# EasyEDA Pro project CameraTargetV1-old.eprj, schematic Schematic1
Create Date: 2023-02-02; Page Name: P1; Project Name: CameraTargetV1; Schematic Name: Schematic1; Update Date: 2023-02-07
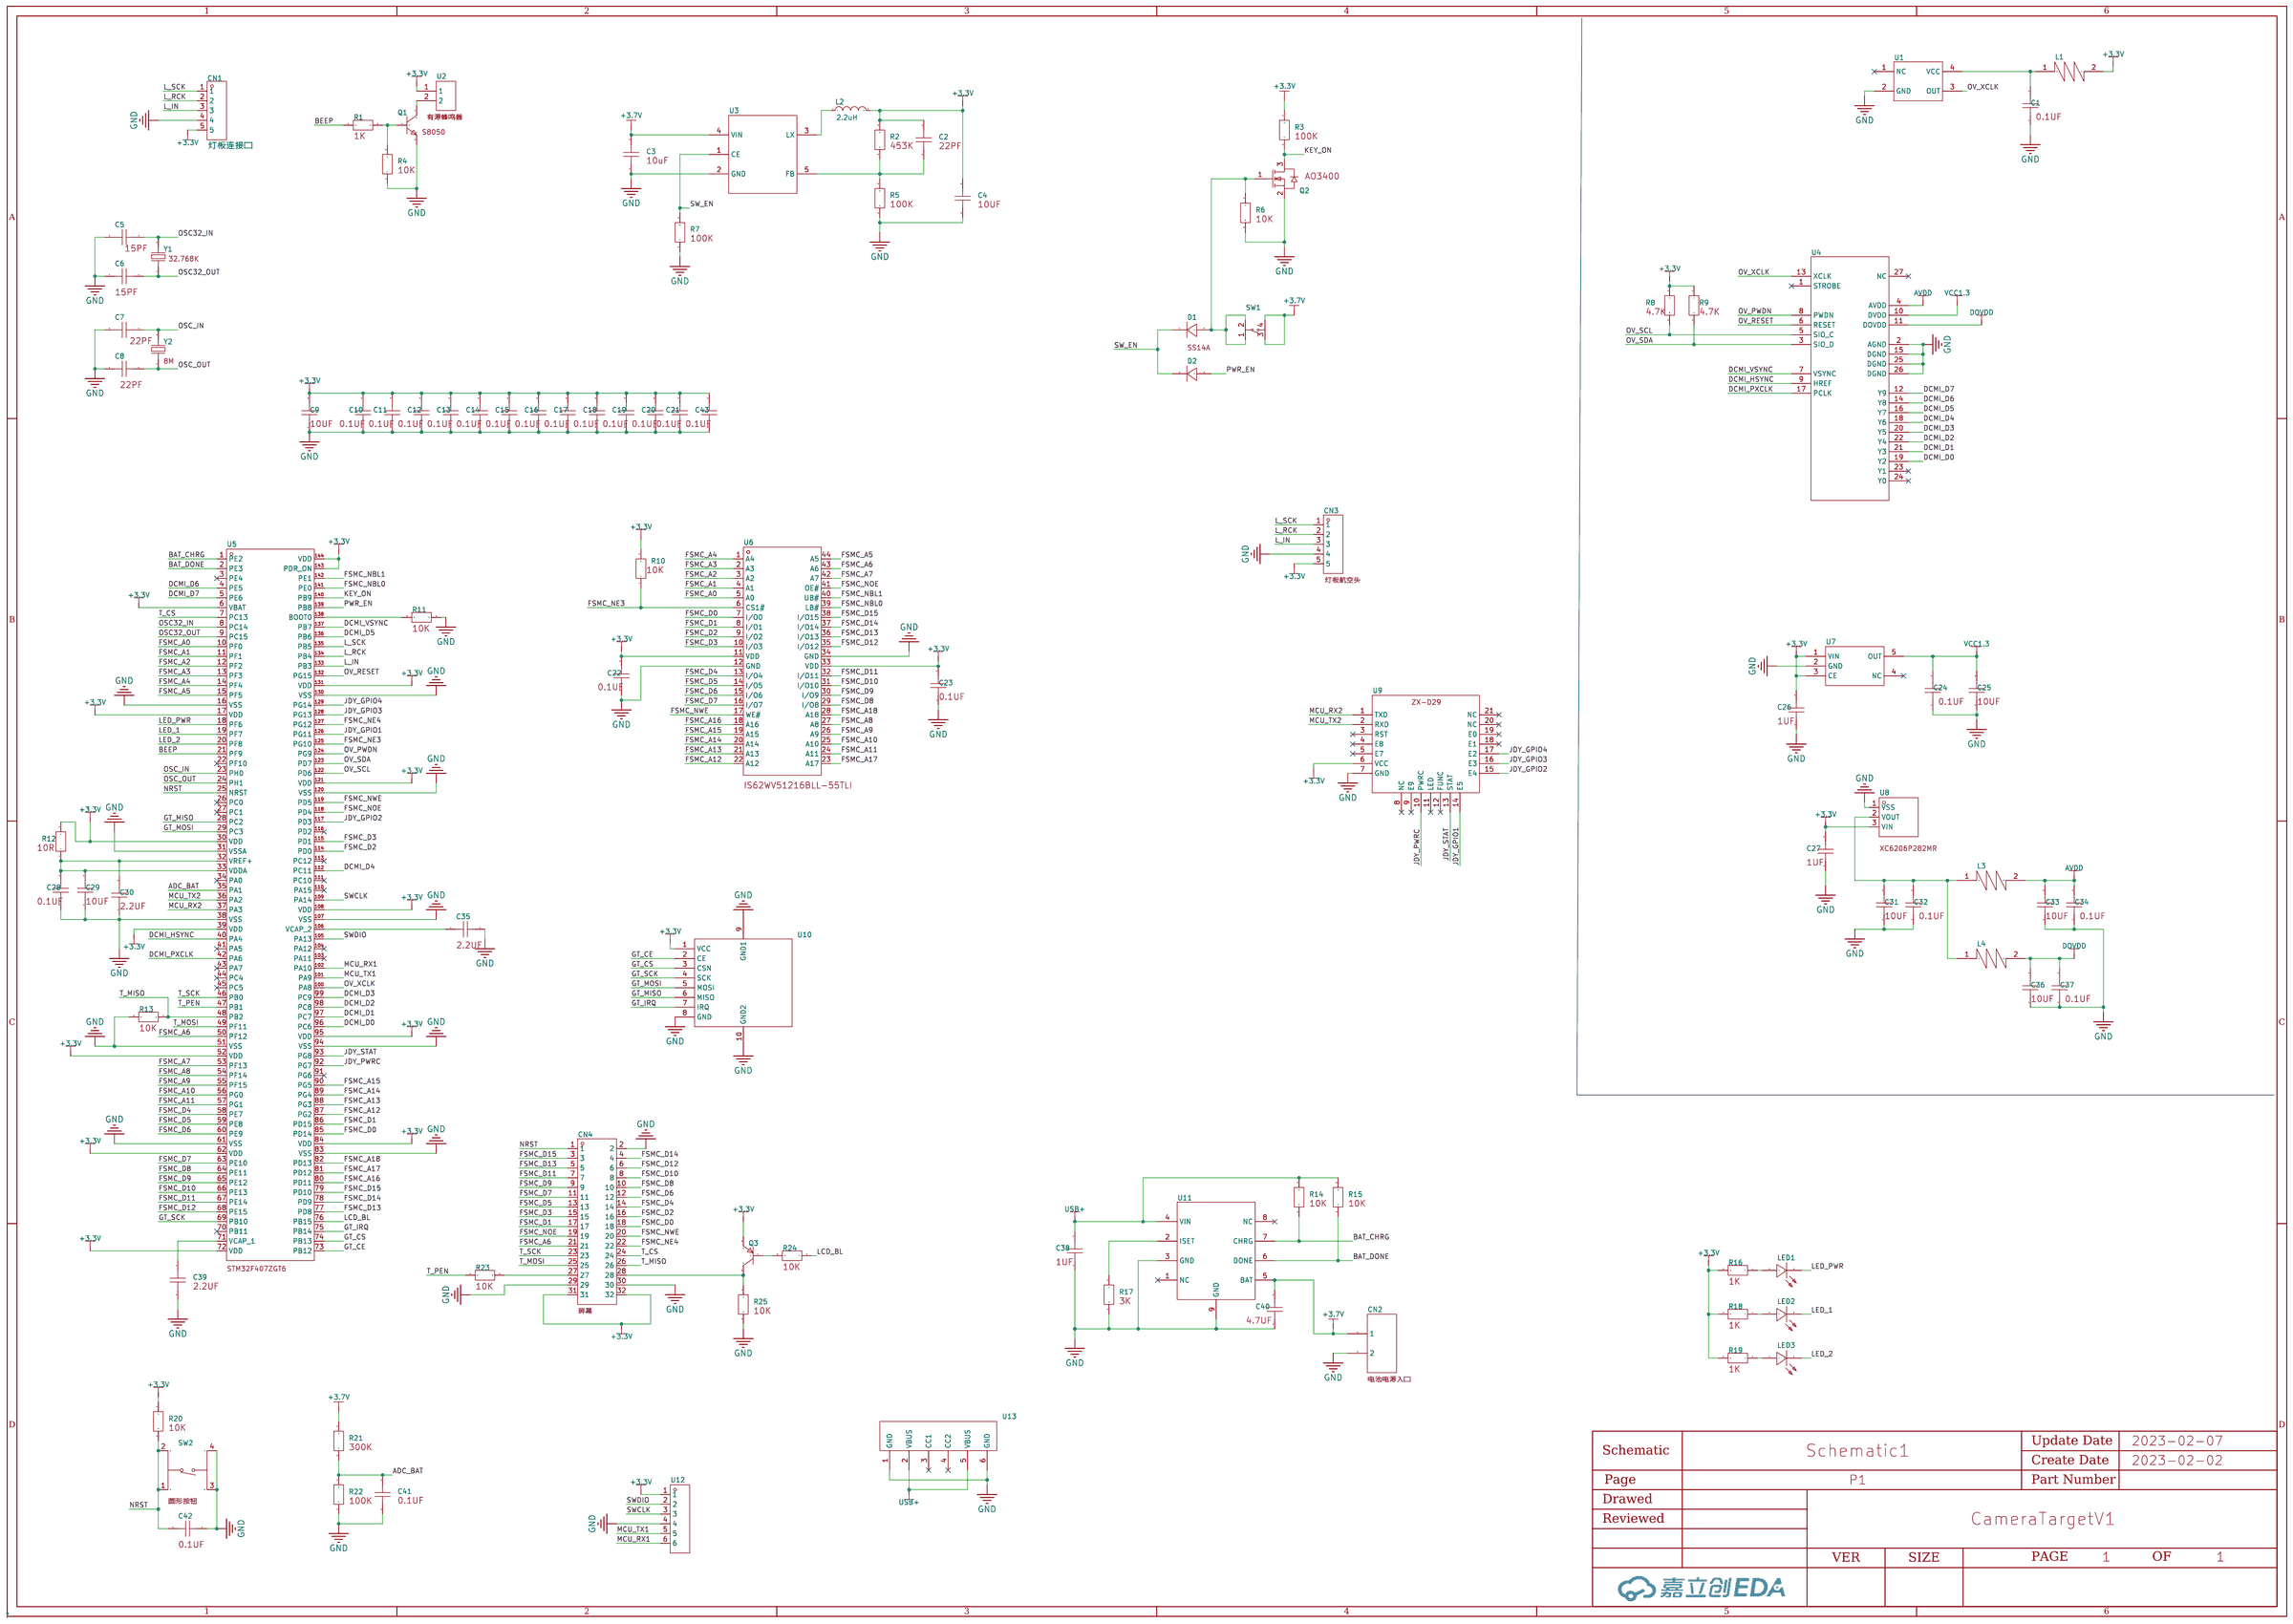
[diagram p0: schematic sheet]

## Parts
C1  -  [0603]
C2  -  [0603]
C3  -  [0603]
C4  -  [0603]
C5  -  [0603]
C6  -  [0603]
C7  -  [0603]
C8  -  [0603]
C9  -  [0603]
C10  -  [0603]
C11  -  [0603]
C12  -  [0603]
C13  -  [0603]
C14  -  [0603]
C15  -  [0603]
C16  -  [0603]
C17  -  [0603]
C18  -  [0603]
C19  -  [0603]
C20  -  [0603]
C21  -  [0603]
C22  -  [0603]
C23  -  [0603]
C24  -  [0603]
C25  -  [0603]
C26  -  [0603]
C27  -  [0603]
C28  -  [0603]
C29  -  [0603]
C30  -  [0603]
C31  -  [0603]
C32  -  [0603]
C33  -  [0603]
C34  -  [0603]
C35  -  [0603]
C36  -  [0603]
C37  -  [0603]
C38  -  [0603]
C39  -  [0603]
C40  -  [0603]
C41  -  [0603]
C42  -  [0603]
C43  -  [0603]
CN1  灯板连接口  [CONN-TH_5P-P2.50_HX25003-5A]
CN2  -  [XH2.54插件2P]
CN3  HDGC2501WR-5P  [CONN-TH_5P-P2.50_HDGC2501WR-5P]
CN4  BH-00169  [IDC-TH_BH-00169]
D1  SS14A  [SMA_L4.3-W2.6-LS5.2-RD]
D2  SS14A  [SMA_L4.3-W2.6-LS5.2-RD]
L1  -  [0420]
L2  2.2uH  [IND-SMD_L4.0-W4.0_0.47UH04209.5A]
L3  -  [0420]
L4  -  [0420]
LED1  RED  [LED0603-R-RD_RED]
LED2  NCD0603R3  [LED0603-R-RD_RED]
LED3  NCD0603R3  [LED0603-R-RD_RED]
Q1  S8050  [SOT-23-3_L2.9-W1.6-P1.90-LS2.8-BR]
Q2  AO3400  [SOT-23_L2.9-W1.3-P1.90-LS2.4-BR]
Q3  S9012  [SOT-23-3_L2.9-W1.6-P1.90-LS2.8-BR]
R1  -  [0603]
R2  -  [0603]
R3  -  [0603]
R4  -  [0603]
R5  -  [0603]
R6  -  [0603]
R7  -  [0603]
R8  -  [0603]
R9  -  [0603]
R10  -  [0603]
R11  -  [0603]
R12  -  [0603]
R13  -  [0603]
R14  -  [0603]
R15  -  [0603]
R16  -  [0603]
R17  -  [0603]
R18  -  [0603]
R19  -  [0603]
R20  -  [0603]
R21  -  [0603]
R22  -  [0603]
R23  -  [0603]
R24  -  [0603]
R25  -  [0603]
SW1  -  [按钮开关]
SW2  1TS001G-2700-1500-CT  [SW-SMD_4P-L5.1-W5.1-P3.70-LS6.5-TL-2]
U1  -  [5032-4P]
U2  -  [0905蜂鸣器]
U3  -  [PW2051]
U4  -  [OV2640]
U5  STM32F407ZGT6  [LQFP-144_L20.0-W20.0-P0.50-LS22.0-BL]
U6  IS62WV51216BLL-55TLI  [TSOP-44_L18.4-W10.2-P0.80-LS11.8-BL]
U7  -  [XC6219B132MR]
U8  XC6206P282MR  [SOT-23-3_L2.9-W1.3-P1.90-LS2.4-BR]
U9  -  [ZX-D29]
U10  -  [GT-24]
U11  -  [PW4056]
U12  HDGC2501WR-6P  [CONN-TH_6P-P2.50_HDGC_HDGC2501WR-6P]
U13  -  [typec]
Y1  -  [3215]
Y2  -  [5032]

## Library data of the parts
C1 C10-C24 C28 C32 C34 C37 C41-C43 = 电容: 0603 标准贴片电容; Capacitance: 0.1UF
C2 C7 C8 = 电容: 0603 标准贴片电容; Capacitance: 22PF
C3 = 电容: 0603 标准贴片电容; Capacitance: 10uF
C4 C9 C25 C29 C31 C33 C36 = 电容: 0603 标准贴片电容; Capacitance: 10UF
C5 C6 = 电容: 0603 标准贴片电容; Capacitance: 15PF
C26 C27 C38 = 电容: 0603 标准贴片电容; Capacitance: 1UF
C30 C35 C39 = 电容: 0603 标准贴片电容; Capacitance: 2.2UF
C40 = 电容: 0603 标准贴片电容; Capacitance: 4.7UF
CN1 = HX25003-5A: 参考系列:XH;间距:2.5mm;插针结构:1x5P;排数:1;每排PIN数:5;行距:-;公母:公型插针;安装方式:直插;额定电流:-;工作温度范围:-;; LCSC Part Name: XH 2.5mm 1x5P 直插; Supplier Part: C442302; Manufacturer: HX(红星); Supplier Footprint: 插件,P=2.5mm; JLCPCB Part Class: Extended Part; Datasheet: https://atta.szlcsc.com/upload/public/pdf/source/20191028/C442302_E66AD84792E19526D7353D56EEE1C29F.pdf; Supplier: LCSC; Reference Series: XH; Pitch: 2.5mm; Pins Structure: 1x5P; Number of Rows: 1; Number of PINs Per Row: 5; Gender: 公型插针; Mounting Style: 直插
CN2 = XH2.54插件2P: 电池电源入口
CN3 = HDGC2501WR-5P: 灯板航空头; LCSC Part Name: XH2.5弯针 5P; Supplier Part: C5175258; Manufacturer: HDGC(华德共创); Supplier Footprint: 弯插,P=2.5mm; Datasheet: https://atta.szlcsc.com/upload/public/pdf/source/20220916/5D6D01E77D919FBB15E2FEFFF7AE5019.pdf; Supplier: LCSC
CN4 = BH-00169: 屏幕; LCSC Part Name: 2.54mm 每排P数:16 排数:2; Supplier Part: C2685073; Manufacturer: Liansheng(连盛); Supplier Footprint: 直插,P=2.54mm; JLCPCB Part Class: Extended Part; Datasheet: https://atta.szlcsc.com/upload/public/pdf/source/20210125/C2685073_294C4BB09F754431070A9C1995E03CCF.pdf; Supplier: LCSC; Connector Type: 简牛座; Pitch: 2.54mm; Pin Number in each Row: 16; Number of Rows: 2; Row Spacing: 2.54mm; Holder Type: 直插; Current Rating (Max): 3A; Operating Temperature Range: -40~+105
D1 D2 = SS14A: 直流反向耐压(Vr):40V;平均整流电流(Io):1A;正向压降(Vf):500mV@1A;; LCSC Part Name: 40V 1A 500mV@1A; Supplier Part: C211770; Manufacturer: YANGJIE(扬杰); Supplier Footprint: SMA(DO-214AC); JLCPCB Part Class: Extended Part; Datasheet: https://atta.szlcsc.com/upload/public/pdf/source/20180504/C211770_627C435F34E9C107E4A4301F69D28675.pdf; Supplier: LCSC; Reverse Voltage (Vr): 40V; Average Rectified Current (Io): 1A; Forward Voltage (Vf@If): 500mV@1A
L1 L3 L4 = 3.3uh电感
L2 = 2.2uh3a电感: 电感值:2.2uH;精度:±20%;额定电流:3A;直流电阻(DCR):-;; Rated Current: 3A; Supplier: LCSC; Supplier Part: C438930; Supplier Footprint: SMD; LCSC Part Name: 2.2uH ±20% 3A; Tolerance: ±20%; Manufacturer: Cybermax(思博科技); Manufacturer Part: CMLO0420H2R2MTT
LED1-LED3 = NCD0603R3: 尺寸1.6x0.8x0.8；IF=20ma：1.6~2.6v，620~640nm,51~150mcd金线，光强高，功耗低，可靠性好，寿命长; LCSC Part Name: 红色;贴片LED;0603红灯;; Supplier Part: C3151730; Manufacturer: 国星光电; Supplier Footprint: 0603; JLCPCB Part Class: Extended Part; Datasheet: https://atta.szlcsc.com/upload/public/pdf/source/20220704/CBFF28C1847A97213A75929E60B7DDE7.pdf; Supplier: LCSC
Q1 = S8050_C105433: 晶体管类型:NPN;集射极击穿电压(Vceo):25V;集电极电流(Ic):500mA;功率(Pd):300mW;集电极截止电流(Icbo):100nA;集电极-发射极饱和电压(VCE(sat)@Ic,Ib):600mV@500mA,50mA;直流电流增益(hFE@Ic,Vce):120@50mA,1V;特征频率(fT):150MHz;工作温度:+150@(Tj);; LCSC Part Name: NPN 25V 500mA L档 120-200; Supplier Part: C105433; Manufacturer: CJ(江苏长电/长晶); Supplier Footprint: SOT-23-3L; JLCPCB Part Class: Extended Part; Datasheet: https://atta.szlcsc.com/upload/public/pdf/source/20170415/1492237762328.pdf; Supplier: LCSC; Transistor Type: NPN; Collector-Emitter Breakdown Voltage (Vceo): 25V; Collector Current (Ic): 500mA; Power Dissipation (Pd): 300mW; Collector Cut-Off Current (Icbo): 100nA; Collector-Emitter Saturation Voltage (VCE(sat)@Ic,Ib): 600mV@500mA,50mA; DC Current Gain (hFE@Ic,Vce): 120@50mA,1V; Transition Frequency (fT): 150MHz; Operating Temperature: +150@(Tj)
Q2 = AO3400: 类型:N沟道;漏源电压(Vdss):30V;连续漏极电流(Id):5.8A;功率(Pd):1.5W;导通电阻(RDS(on)@Vgs,Id):35mΩ@10V,5.8A;阈值电压(Vgs(th)@Id):1.2V@250uA;栅极电荷(Qg@Vgs):-;输入电容(Ciss@Vds):1050pF@15V;反向传输电容(Crss@Vds):77pF@15V;工作温度:+150@(Tj);; LCSC Part Name: N沟道 30V 5.8A; Supplier Part: C2938367; Manufacturer: GOODWORK(固得沃克); Supplier Footprint: SOT23; JLCPCB Part Class: Extended Part; Datasheet: https://atta.szlcsc.com/upload/public/pdf/source/20211229/1DE691E24B5B31BB262C463D0489A9AB.pdf; Supplier: LCSC; Type: N沟道; Drain Source Voltage (Vdss): 30V; Continuous Drain Current (Id): 5.8A; Power Dissipation (Pd): 1.5W; Drain Source On Resistance (RDS(on)@Vgs,Id): 35mΩ@10V,5.8A; Gate Threshold Voltage (Vgs(th)@Id): 1.2V@250uA; Input Capacitance (Ciss@Vds): 1050pF@15V; Reverse Transfer Capacitance (Crss@Vds): 77pF@15V; Operating Temperature: +150@(Tj)
Q3 = S9012_C107405: 晶体管类型:PNP;集射极击穿电压(Vceo):25V;集电极电流(Ic):500mA;功率(Pd):300mW;集电极截止电流(Icbo):100nA;集电极-发射极饱和电压(VCE(sat)@Ic,Ib):600mV@500mA,50mA;直流电流增益(hFE@Ic,Vce):120@50mA,1V;特征频率(fT):150MHz;工作温度:+150@(Tj);; LCSC Part Name: PNP 25V 500mA; Supplier Part: C107405; Manufacturer: CJ(江苏长电/长晶); Supplier Footprint: SOT-23-3L; JLCPCB Part Class: Extended Part; Datasheet: https://atta.szlcsc.com/upload/public/pdf/source/20170413/1492062773144.pdf; Supplier: LCSC; Transistor Type: PNP; Collector-Emitter Breakdown Voltage (Vceo): 25V; Collector Current (Ic): 500mA; Power Dissipation (Pd): 300mW; Collector Cut-Off Current (Icbo): 100nA; Collector-Emitter Saturation Voltage (VCE(sat)@Ic,Ib): 600mV@500mA,50mA; DC Current Gain (hFE@Ic,Vce): 120@50mA,1V; Transition Frequency (fT): 150MHz; Operating Temperature: +150@(Tj)
R1 R16 R18 R19 = 电阻: 0603 标准贴片电阻; Resistance: 1K
R2 = 电阻: 0603 标准贴片电阻; Resistance: 453K
R3 R5 R7 R22 = 电阻: 0603 标准贴片电阻; Resistance: 100K
R4 R6 R10 R11 R13-R15 R20 R23-R25 = 电阻: 0603 标准贴片电阻; Resistance: 10K
R8 R9 = 电阻: 0603 标准贴片电阻; Resistance: 4.7K
R12 = 电阻: 0603 标准贴片电阻; Resistance: 10R
R17 = 电阻: 0603 标准贴片电阻; Resistance: 3K
R21 = 电阻: 0603 标准贴片电阻; Resistance: 300K
SW1 = 按键开关
SW2 = 1TS001G-2700-1500-CT: 触点电流:20mA;额定电压(DC):12V;电路结构:单刀单掷;安装方式:立贴;按钮形状:圆形按钮;带灯:-;开关长度:5.1mm;开关宽度:5.1mm;开关高度:0.3mm;; LCSC Part Name: 铜头按钮; Supplier Part: C318800; Manufacturer: HYP(鸿源精密); Supplier Footprint: SMD,5.1x5.1mm; JLCPCB Part Class: Extended Part; Datasheet: https://atta.szlcsc.com/upload/public/pdf/source/20200109/C318800_E3EE45BECD3EEEC6701309AC007B685B.pdf; Supplier: LCSC; Contact Current: 20mA; Voltage Rating (DC): 12V; Circuit: 单刀单掷; Mounting Style: 立贴; Actuator Style: 圆形按钮; Switch Length: 5.1mm; Switch Width: 5.1mm; Switch Height: 0.3mm
U1 = 24M有源晶振
U2 = 0905蜂鸣器
U3 = PW2051: 3.7V转3.3V降压芯片
U4 = OV2640
U5 = STM32F407ZGT6: CPU内核:ARM Cortex-M4;CPU最大主频:168MHz;工作电压范围:1.8V~3.6V;内部振荡器:有;程序 FLASH容量:1MB;RAM总容量:192KB;EEPROM/数据 FLASH容量:-;GPIO端口数量:114;ADC(单元数/通道数/位数):1@x24ch/12bit;DAC(单元数/通道数/位数):1@x2ch/12bit;外设/功能/协议栈:欠压检测/复位；DMA；LCD驱动；看门狗；POR；PWM;工作温度范围:-40~+85;; LCSC Part Name: ARM Cortex-M4 168MHz 闪存：1MB RAM：192KB; Supplier Part: C19156; Manufacturer: ST(意法半导体); Supplier Footprint: LQFP-144(20x20); JLCPCB Part Class: Extended Part; Datasheet: https://atta.szlcsc.com/upload/public/pdf/source/20140724/1457707162528.pdf; Supplier: LCSC; CPU Core: ARM Cortex-M4; Maximum Frequency: 168MHz; Supply Voltage Range: 1.8V~3.6V; Internal Oscillator: 有; Program FLASH Size: 1MB; RAM Size: 192KB; GPIO Ports Number: 114; ADC (Units/Channels/bits): 1@x24ch/12bit; DAC (Units/Channels/bits): 1@x2ch/12bit; Peripherals / Functions / Protocol Stacks: 欠压检测/复位；DMA；LCD驱动；看门狗；POR；PWM; Operating Temperature Range: -40~+85
U6 = IS62WV51216BLL-55TLI: 8-Mbit(512K  16bit)，并行接口，工作电压：2.5V to 3.6V; Supplier Part: C11315; Manufacturer: ISSI(美国芯成); Supplier Footprint: TSOP-44-10.2mm; JLCPCB Part Class: Extended Part; Datasheet: https://atta.szlcsc.com/upload/public/pdf/source/20130225/1457706593006.pdf; Supplier: LCSC
U7 = XC6219B132MR: 3.3V转1.3V电压芯片
U8 = XC6206P282MR: Supplier Part: C2934870; Manufacturer: YONGYUTAI(永裕泰); Supplier Footprint: SOT-23; JLCPCB Part Class: Extended Part; Datasheet: https://atta.szlcsc.com/upload/public/pdf/source/20211028/7BAE2D9FEDA11A30305FD6FAB15CFEC6.pdf; Supplier: LCSC
U9 = ZX-D29: 蓝牙5.0模块
U10 = GT-24
U11 = PW4056: 带OVP充电芯片
U12 = HDGC2501WR-6P: LCSC Part Name: XH2.5弯针 6P; Supplier Part: C5175259; Manufacturer: HDGC(华德共创); Supplier Footprint: 弯插,P=2.5mm; JLCPCB Part Class: Extended Part; Datasheet: https://atta.szlcsc.com/upload/public/pdf/source/20220916/1B5A21F1CD201E9CB820F8C57DCAD896.pdf; Supplier: LCSC
U13 = typec: type c接口
Y1 = 32.768KHz晶振: 32.768K
Y2 = 8MHz晶振: 8M

## Nets
+3.3V: C2.2 C4.2 C9.2 C10.2 C11.2 C12.2 C13.2 C14.2 C15.2 C16.2 C17.2 C18.2 C19.2 C20.2 C21.2 C22.2 C23.2 C26.2 C27.2 C43.2 CN1.5 CN3.5 CN4.31 CN4.32 L1.2 L2.2 Q3.2 R2.2 R3.1 R8.1 R9.1 R10.2 R12.2 R16.2 R18.2 R19.2 R20.1 U2.1 U5.6(VBAT) U5.17(VDD) U5.30(VDD) U5.39(VDD) U5.52(VDD) U5.62(VDD) U5.72(VDD) U5.84(VDD) U5.95(VDD) U5.108(VDD) U5.121(VDD) U5.131(VDD) U5.143(PDR_ON) U5.144(VDD) U6.11(VDD) U6.33(VDD) U7.1(VIN) U7.3(CE) U8.3(VIN) U9.6(VCC) U10.1(VCC) U12.1
+3.7V: C3.2 C40.2 CN2.1 R21.1 SW1.3(C) SW1.4(D) U3.4(VIN) U11.5(BAT)
AVDD: C33.2 C34.2 L3.2 U4.4(AVDD)
GND: C1.1 C3.1 C4.1 C5.2 C6.2 C7.2 C8.2 C9.1 C10.1 C11.1 C12.1 C13.1 C14.1 C15.1 C16.1 C17.1 C18.1 C19.1 C20.1 C21.1 C22.1 C23.1 C24.1 C25.1 C26.1 C27.1 C28.1 C29.1 C30.1 C31.1 C32.1 C33.1 C34.1 C35.2 C36.1 C37.1 C38.1 C39.2 C40.1 C41.2 C42.1 C43.1 CN1.4 CN2.2 CN3.4 CN4.2 CN4.29 CN4.30 Q1.2 Q2.2(S) R4.1 R5.1 R6.2 R7.1 R11.1 R13.2 R17.2 R22.2 R25.2 SW2.3(C) SW2.4(D) U1.2(GND) U3.2(GND) U4.2(AGND) U4.15(DGND) U4.25(DGND) U4.26(DGND) U5.16(VSS) U5.31(VSSA) U5.38(VSS) U5.51(VSS) U5.61(VSS) U5.83(VSS) U5.94(VSS) U5.107(VSS) U5.120(VSS) U5.130(VSS) U6.12(GND) U6.34(GND) U7.2(GND) U8.1(VSS) U9.7(GND) U10.8(GND) U10.9(GND1) U10.10(GND2) U11.3(GND) U11.9(GND) U12.4 U13.1(GND) U13.6(GND)
VCC1.3: C24.2 C25.2 U4.10(DVDD) U7.5(OUT)
ADC_BAT: C41.1 R21.2 R22.1 U5.35(PA1)
BAT_CHRG: R14.1 U5.1(PE2) U11.7(CHRG)
BAT_DONE: R15.1 U5.2(PE3) U11.6(DONE)
BEEP: R1.1 U5.21(PF9)
DCMI_D0: U4.19(Y2) U5.96(PC6)
DCMI_D1: U4.21(Y3) U5.97(PC7)
DCMI_D2: U4.22(Y4) U5.98(PC8)
DCMI_D3: U4.20(Y5) U5.99(PC9)
DCMI_D4: U4.18(Y6) U5.112(PC11)
DCMI_D5: U4.16(Y7) U5.136(PB6)
DCMI_D6: U4.14(Y8) U5.4(PE5)
DCMI_D7: U4.12(Y9) U5.5(PE6)
DCMI_HSYNC: U4.9(HREF) U5.40(PA4)
DCMI_PXCLK: U4.17(PCLK) U5.42(PA6)
DCMI_VSYNC: U4.7(VSYNC) U5.137(PB7)
DOVDD: C36.2 C37.2 L4.2 U4.11(DOVDD)
FSMC_A0: U5.10(PF0) U6.5(A0)
FSMC_A1: U5.11(PF1) U6.4(A1)
FSMC_A2: U5.12(PF2) U6.3(A2)
FSMC_A3: U5.13(PF3) U6.2(A3)
FSMC_A4: U5.14(PF4) U6.1(A4)
FSMC_A5: U5.15(PF5) U6.44(A5)
FSMC_A6: CN4.21 U5.50(PF12) U6.43(A6)
FSMC_A7: U5.53(PF13) U6.42(A7)
FSMC_A8: U5.54(PF14) U6.27(A8)
FSMC_A9: U5.55(PF15) U6.26(A9)
FSMC_A10: U5.56(PG0) U6.25(A10)
FSMC_A11: U5.57(PG1) U6.24(A11)
FSMC_A12: U5.87(PG2) U6.22(A12)
FSMC_A13: U5.88(PG3) U6.21(A13)
FSMC_A14: U5.89(PG4) U6.20(A14)
FSMC_A15: U5.90(PG5) U6.19(A15)
FSMC_A16: U5.80(PD11) U6.18(A16)
FSMC_A17: U5.81(PD12) U6.23(A17)
FSMC_A18: U5.82(PD13) U6.28(A18)
FSMC_D0: CN4.18 U5.85(PD14) U6.7(I/O0)
FSMC_D1: CN4.17 U5.86(PD15) U6.8(I/O1)
FSMC_D2: CN4.16 U5.114(PD0) U6.9(I/O2)
FSMC_D3: CN4.15 U5.115(PD1) U6.10(I/O3)
FSMC_D4: CN4.14 U5.58(PE7) U6.13(I/O4)
FSMC_D5: CN4.13 U5.59(PE8) U6.14(I/O5)
FSMC_D6: CN4.12 U5.60(PE9) U6.15(I/O6)
FSMC_D7: CN4.11 U5.63(PE10) U6.16(I/O7)
FSMC_D8: CN4.10 U5.64(PE11) U6.29(I/O8)
FSMC_D9: CN4.9 U5.65(PE12) U6.30(I/O9)
FSMC_D10: CN4.8 U5.66(PE13) U6.31(I/O10)
FSMC_D11: CN4.7 U5.67(PE14) U6.32(I/O11)
FSMC_D12: CN4.6 U5.68(PE15) U6.35(I/O12)
FSMC_D13: CN4.5 U5.77(PD8) U6.36(I/O13)
FSMC_D14: CN4.4 U5.78(PD9) U6.37(I/O14)
FSMC_D15: CN4.3 U5.79(PD10) U6.38(I/O15)
FSMC_NBL0: U5.141(PE0) U6.39(LB#)
FSMC_NBL1: U5.142(PE1) U6.40(UB#)
FSMC_NE3: R10.1 U5.125(PG10) U6.6(CS1#)
FSMC_NE4: CN4.22 U5.127(PG12)
FSMC_NOE: CN4.19 U5.118(PD4) U6.41(OE#)
FSMC_NWE: CN4.20 U5.119(PD5) U6.17(WE#)
GT_CE: U5.73(PB12) U10.2(CE)
GT_CS: U5.74(PB13) U10.3(CSN)
GT_IRQ: U5.75(PB14) U10.7(IRQ)
GT_MISO: U5.28(PC2) U10.6(MISO)
GT_MOSI: U5.29(PC3) U10.5(MOSI)
GT_SCK: U5.69(PB10) U10.4(SCK)
JDY_GPIO1: U5.126(PG11) U9.14(E5)
JDY_GPIO2: U5.117(PD3) U9.15(E4)
JDY_GPIO3: U5.128(PG13) U9.16(E3)
JDY_GPIO4: U5.129(PG14) U9.17(E2)
JDY_PWRC: U5.92(PG7) U9.10(PWRC)
JDY_STAT: U5.93(PG8) U9.13(STAT)
KEY_ON: Q2.3(D) R3.2 U5.140(PB9)
L_IN: CN1.3 CN3.3 U5.133(PB3)
L_RCK: CN1.2 CN3.2 U5.134(PB4)
L_SCK: CN1.1 CN3.1 U5.135(PB5)
LCD_BL: R24.1 U5.76(PB15)
LED_1: LED2.2(K) U5.19(PF7)
LED_2: LED3.2(K) U5.20(PF8)
LED_PWR: LED1.2(K) U5.18(PF6)
MCU_RX1: U5.102(PA10) U12.6
MCU_RX2: U5.37(PA3) U9.1(TXD)
MCU_TX1: U5.101(PA9) U12.5
MCU_TX2: U5.36(PA2) U9.2(RXD)
NRST: C42.2 CN4.1 R20.2 SW2.1(A) SW2.2(B) U5.25(NRST)
OSC32_IN: C5.1 U5.8(PC14) Y1.2
OSC32_OUT: C6.1 U5.9(PC15) Y1.1
OSC_IN: C7.1 U5.23(PH0) Y2.2
OSC_OUT: C8.1 U5.24(PH1) Y2.1
OV_PWDN: U4.8(PWDN) U5.124(PG9)
OV_RESET: U4.6(RESET) U5.132(PG15)
OV_SCL: R8.2 U4.5(SIO_C) U5.122(PD6)
OV_SDA: R9.2 U4.3(SIO_D) U5.123(PD7)
OV_XCLK: U1.3(OUT) U4.13(XCLK) U5.100(PA8)
PWR_EN: D2.2(A) U5.139(PB8)
SW_EN: D1.1(C) D2.1(C) R7.2 U3.1(CE)
SWCLK: U5.109(PA14) U12.3
SWDIO: U5.105(PA13) U12.2
T_CS: CN4.24 U5.7(PC13)
T_MISO: CN4.26 R13.1 U5.48(PB2)
T_MOSI: CN4.25 U5.49(PF11)
T_PEN: R23.2 U5.47(PB1)
T_SCK: CN4.23 U5.46(PB0)
USB+: C38.2 R14.2 R15.2 U11.4(VIN) U13.2(VBUS) U13.5(VBUS)
$1N8883: C31.2 C32.2 L3.1 L4.1 U8.2(VOUT)
$1N11070: C1.2 L1.1 U1.4(VCC)
$1N15938: Q1.1 R1.2 R4.2
$1N16259: Q1.3 U2.2
$1N20605: C28.2 C29.2 C30.2 R12.1 U5.32(VREF+) U5.33(VDDA)
$1N21732: C39.1 U5.71(VCAP_1)
$1N22015: C35.1 U5.106(VCAP_2)
$1N22293: R11.2 U5.138(BOOT0)
$1N39311: L2.1 U3.3(LX)
$1N39568: C2.1 R2.1 R5.2 U3.5(FB)
$1N41074: D1.2(A) Q2.1(G) R6.1 SW1.1(A) SW1.2(B)
$1N49914: R17.1 U11.2(ISET)
$1N58921: LED1.1(A) R16.1
$1N63388: LED2.1(A) R18.1
$1N63497: LED3.1(A) R19.1
$1N92764: CN4.27 R23.1
$1N105168: Q3.1 R24.2
$1N105530: CN4.28 Q3.3 R25.1

Not connected (* = marked no-connect by the designer): U1 1(NC)*; U4 1(STROBE)* 23(Y1)* 24(Y0)* 27(NC)*; U5 3(PE4)* 22(PF10)* 26(PC0)* 27(PC1)* 34(PA0)* 41(PA5)* 43(PA7)* 44(PC4)* 45(PC5)* 70(PB11)* 91(PG6)* 103(PA11)* 104(PA12)* 110(PA15)* 111(PC10)* 113(PC12)* 116(PD2)*; U7 4(NC)*; U9 3(RST)* 4(E8)* 5(E7)* 8(NC)* 9(E9)* 11(LED)* 12(FUNC)* 18(E1)* 19(E0)* 20(NC)* 21(NC)*; U11 1(NC)* 8(NC)*; U13 3(CC1)* 4(CC2)*
